# Altium schematic sheet Principal_Node_Block_Diagram.SchDoc: Principal_Node_Block_Diagram
size A; DrawnBy: Project_Vega_Team; Revision: 1; SheetNumber: 1; SheetTotal: 8
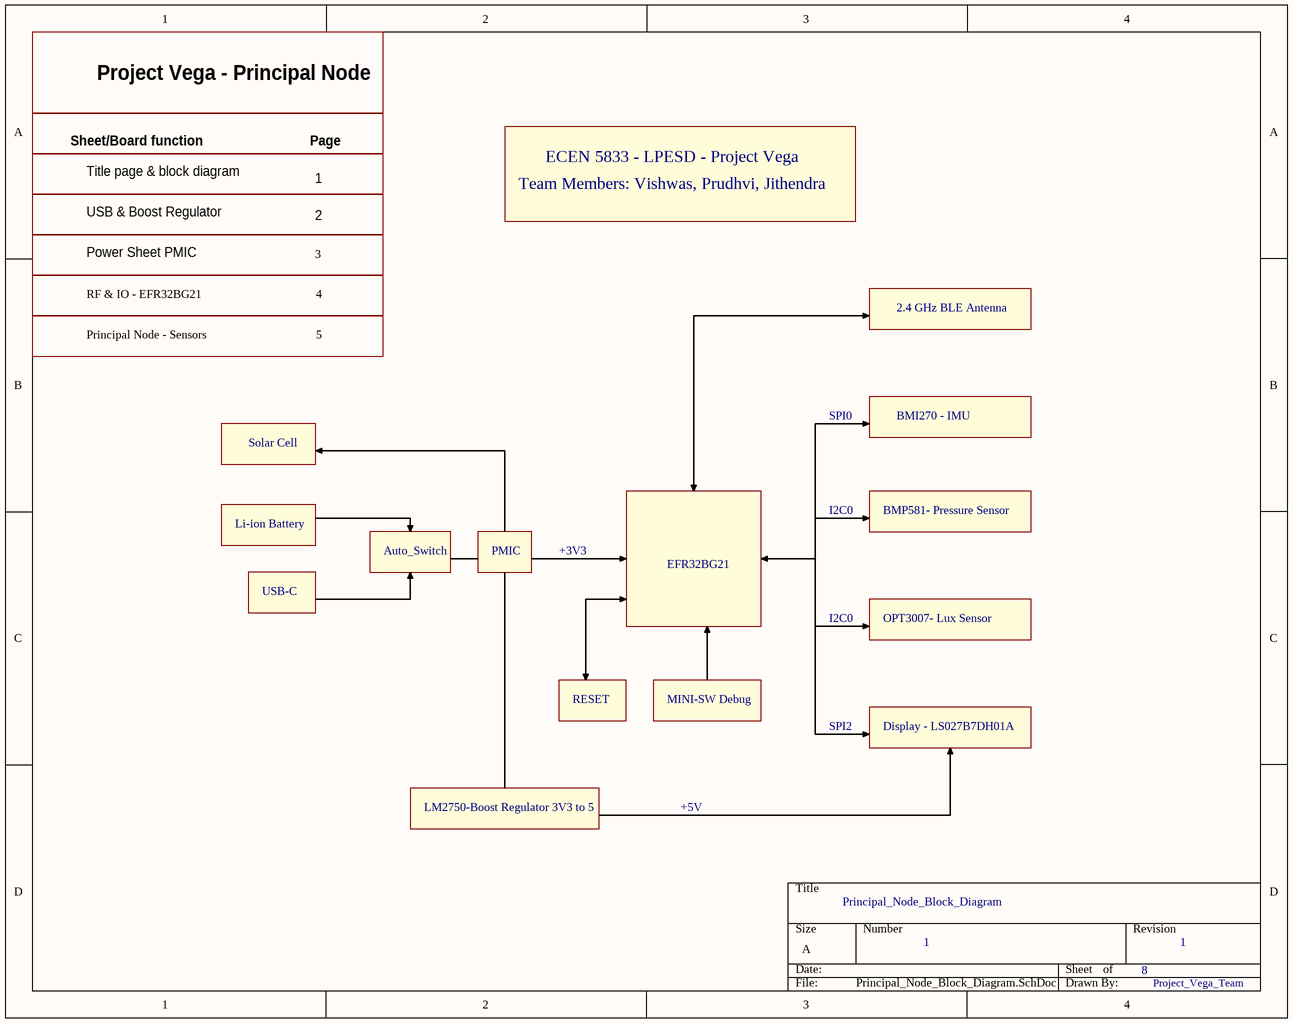
[diagram p0: Principal_Node_Block_Diagram.SchDoc]

## Notes on the sheet
- Project Vega - Principal Node
- Sheet/Board function
- Page
- ECEN 5833 - LPESD - Project Vega
- Title page & block diagram
- USB & Boost Regulator
- 1
- 2
- Team Members: Vishwas, Prudhvi, Jithendra
- Power Sheet PMIC
- RF & IO - EFR32BG21
- 3
- 4
- Principal Node - Sensors
- 5
- 2.4 GHz BLE Antenna
- SPI0
- BMI270 - IMU
- Solar Cell
- Li-ion Battery
- Auto_Switch
- PMIC
- +3V3
- EFR32BG21
- I2C0
- BMP581- Pressure Sensor
- USB-C
- OPT3007- Lux Sensor
- RESET
- MINI-SW Debug
- SPI2
- Display - LS027B7DH01A
- LM2750-Boost Regulator 3V3 to 5
- +5V